# Altium schematic sheet Sheet_1_2023-01-05.schdoc
size 254 x 173 mm
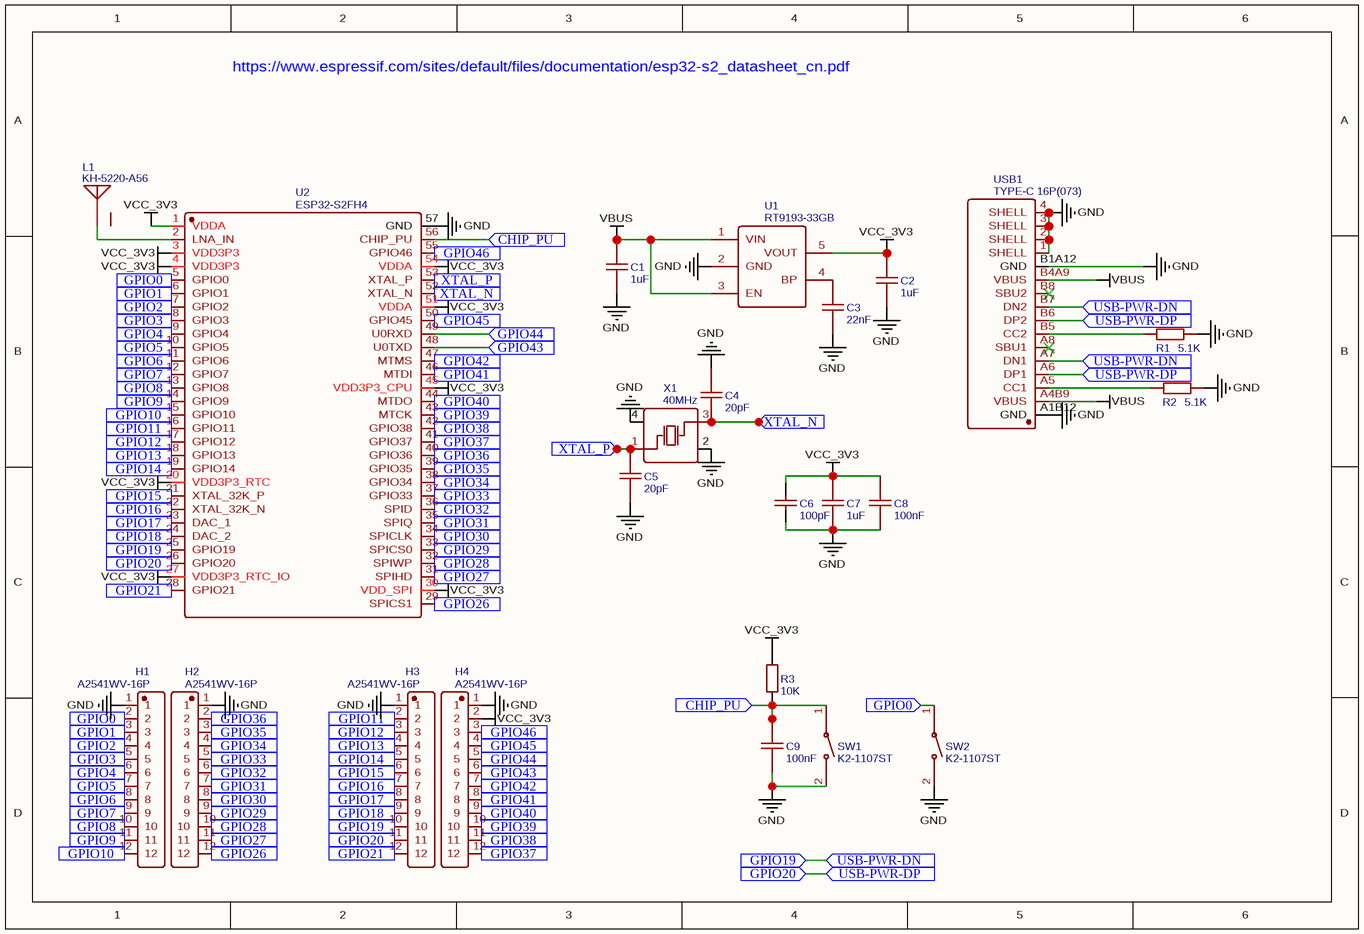
[diagram p0: Sheet_1_2023-01-05.schdoc]

## Parts
C1  1uF  [C0603]
C2  1uF  [C0603]
C3  22nF  [C0603]
C4  20pF  [C0603]
C5  20pF  [C0603]
C6  100pF  [C0603]
C7  1uF  [C0603]
C8  100nF  [C0603]
C9  100nF  [C0603]
H1  A2541WV-16P  [HDR-TH_12P-P2.54-V_A2541HWV-12P]
H2  A2541WV-16P  [HDR-TH_12P-P2.54-V_A2541HWV-12P]
H3  A2541WV-16P  [HDR-TH_12P-P2.54-V_A2541HWV-12P]
H4  A2541WV-16P  [HDR-TH_12P-P2.54-V_A2541HWV-12P]
L1  KH-5220-A56  [ANT-SMD_L5.2-W2.0]
R1  5.1K  [R0603]
R2  5.1K  [R0603]
R3  10K  [R0603]
SW1  K2-1107ST  [KEY-SMD_L6.2-W3.6-LS8.0]
SW2  K2-1107ST  [KEY-SMD_L6.2-W3.6-LS8.0]
U1  RT9193-33GB  [SOT-23-5_L3.0-W1.7-P0.95-LS2.8-BR]
U2  ESP32-S2FH4  [QFN-56_L7.0-W7.0-P0.40-TL-EP4.0]
USB1  TYPE-C 16P(073)  [USB-C-SMD_TYPE-C16PIN_C668624]
X1  40MHz  [OSC-SMD_4P-L3.2-W2.5-BL_SIT8008BI]

## Ports
CHIP_PU (in), GPIO0 (in), GPIO1 (in), GPIO2 (in), GPIO3 (in), GPIO4 (in), GPIO5 (in), GPIO6 (in), GPIO7 (in), GPIO8 (in), GPIO9 (in), GPIO10 (in), GPIO11 (in), GPIO12 (in), GPIO13 (in), GPIO14 (in), GPIO15 (in), GPIO16 (in), GPIO17 (in), GPIO18 (in), GPIO19 (in), GPIO20 (in), GPIO21 (in), GPIO26 (in), GPIO27 (in), GPIO28 (in), GPIO29 (in), GPIO30 (in), GPIO31 (in), GPIO32 (in), GPIO33 (in), GPIO34 (in), GPIO35 (in), GPIO36 (in), GPIO37 (in), GPIO38 (in), GPIO39 (in), GPIO40 (in), GPIO41 (in), GPIO42 (in), GPIO43 (in), GPIO44 (in), GPIO45 (in), GPIO46 (in), USB-PWR-DN (in), USB-PWR-DP (in), XTAL_N (in), XTAL_P (in)

## Nets
GND: C1.2 C2.2 C3.1 C4.2 C5.1 C6.1 C7.1 C8.2 C9.2 H1.1 H2.1 H3.1 H4.1 R1.2 R2.2 SW1.2 SW2.2 U1.2(GND) U2.57(GND) USB1.1(SHELL) USB1.2(SHELL) USB1.3(SHELL) USB1.4(SHELL) USB1.A1B12(GND) USB1.B1A12(GND) X1.2(GND) X1.4(GND)
VBUS: C1.1 U1.1(VIN) U1.3(EN) USB1.A4B9(VBUS) USB1.B4A9(VBUS)
VCC_3V3: C2.1 C6.2 C7.2 C8.1 H4.2 R3.2 U1.5(VOUT) U2.1(VDDA) U2.3(VDD3P3) U2.4(VDD3P3) U2.20(VDD3P3_RTC) U2.27(VDD3P3_RTC_IO) U2.30(VDD_SPI) U2.45(VDD3P3_CPU) U2.51(VDDA) U2.54(VDDA)
CHIP_PU: C9.1 R3.1 SW1.1 U2.56(CHIP_PU) ; port CHIP_PU
GPIO0: H1.2 SW2.1 U2.5(GPIO0) ; port GPIO0
GPIO1: H1.3 U2.6(GPIO1) ; port GPIO1
GPIO2: H1.4 U2.7(GPIO2) ; port GPIO2
GPIO3: H1.5 U2.8(GPIO3) ; port GPIO3
GPIO4: H1.6 U2.9(GPIO4) ; port GPIO4
GPIO5: H1.7 U2.10(GPIO5) ; port GPIO5
GPIO6: H1.8 U2.11(GPIO6) ; port GPIO6
GPIO7: H1.9 U2.12(GPIO7) ; port GPIO7
GPIO8: H1.10 U2.13(GPIO8) ; port GPIO8
GPIO9: H1.11 U2.14(GPIO9) ; port GPIO9
GPIO10: H1.12 U2.15(GPIO10) ; port GPIO10
GPIO11: H3.2 U2.16(GPIO11) ; port GPIO11
GPIO12: H3.3 U2.17(GPIO12) ; port GPIO12
GPIO13: H3.4 U2.18(GPIO13) ; port GPIO13
GPIO14: H3.5 U2.19(GPIO14) ; port GPIO14
GPIO15: H3.6 U2.21(XTAL_32K_P) ; port GPIO15
GPIO16: H3.7 U2.22(XTAL_32K_N) ; port GPIO16
GPIO17: H3.8 U2.23(DAC_1) ; port GPIO17
GPIO18: H3.9 U2.24(DAC_2) ; port GPIO18
GPIO19: H3.10 U2.25(GPIO19) USB1.A7(DN1) USB1.B7(DN2) ; port USB-PWR-DN, port GPIO19
GPIO20: H3.11 U2.26(GPIO20) USB1.A6(DP1) USB1.B6(DP2) ; port USB-PWR-DP, port GPIO20
GPIO21: H3.12 U2.28(GPIO21) ; port GPIO21
GPIO26: H2.12 U2.29(SPICS1) ; port GPIO26
GPIO27: H2.11 U2.31(SPIHD) ; port GPIO27
GPIO28: H2.10 U2.32(SPIWP) ; port GPIO28
GPIO29: H2.9 U2.33(SPICS0) ; port GPIO29
GPIO30: H2.8 U2.34(SPICLK) ; port GPIO30
GPIO31: H2.7 U2.35(SPIQ) ; port GPIO31
GPIO32: H2.6 U2.36(SPID) ; port GPIO32
GPIO33: H2.5 U2.37(GPIO33) ; port GPIO33
GPIO34: H2.4 U2.38(GPIO34) ; port GPIO34
GPIO35: H2.3 U2.39(GPIO35) ; port GPIO35
GPIO36: H2.2 U2.40(GPIO36) ; port GPIO36
GPIO37: H4.12 U2.41(GPIO37) ; port GPIO37
GPIO38: H4.11 U2.42(GPIO38) ; port GPIO38
GPIO39: H4.10 U2.43(MTCK) ; port GPIO39
GPIO40: H4.9 U2.44(MTDO) ; port GPIO40
GPIO41: H4.8 U2.46(MTDI) ; port GPIO41
GPIO42: H4.7 U2.47(MTMS) ; port GPIO42
GPIO43: H4.6 U2.48(U0TXD) ; port GPIO43
GPIO44: H4.5 U2.49(U0RXD) ; port GPIO44
GPIO45: H4.4 U2.50(GPIO45) ; port GPIO45
GPIO46: H4.3 U2.55(GPIO46) ; port GPIO46
XTAL_N: C4.1 U2.52(XTAL_N) X1.3(OSC2) ; port XTAL_N
XTAL_P: C5.2 U2.53(XTAL_P) X1.1(OSC1) ; port XTAL_P
NetC3_2: C3.2 U1.4(BP)
NetL1_1: L1.1(ANT) U2.2(LNA_IN)
NetR1_1: R1.1 USB1.B5(CC2)
NetR2_1: R2.1 USB1.A5(CC1)

Not connected (* = marked no-connect by the designer): L1 2; USB1 A8(SBU1)* B8(SBU2)*

## Notes on the sheet
- https://www.espressif.com/sites/default/files/documentation/esp32-s2_datasheet_cn.pdf

## Library data of the parts
C1 C2 C7 = 1uF: BOM_Manufacturer: YAGEO; BOM_Manufacturer Part: AC0603KRX7R6BB105; nameAlias: Capacitance; Contributor: LCSC; BOM_Supplier: LCSC; BOM_Supplier Part: C726554; BOM_JLCPCB Part Class: Extended Part; spicePre: C; spiceSymbolName: AC0603KRX7R6BB105
C3 = 22nF: BOM_Manufacturer: KEMET; BOM_Manufacturer Part: C0603C223K5RAC3121; nameAlias: Capacitance; Contributor: LCSC; BOM_Supplier: LCSC; BOM_Supplier Part: C599708; BOM_JLCPCB Part Class: Extended Part; spicePre: C; spiceSymbolName: C0603C223K5RAC3121
C4 C5 = 20pF: BOM_Manufacturer: KEMET; BOM_Manufacturer Part: C0603C200J5GAC7867; nameAlias: Capacitance; Contributor: LCSC; BOM_Supplier: LCSC; BOM_Supplier Part: C599688; BOM_JLCPCB Part Class: Extended Part; spicePre: C; spiceSymbolName: C0603C200J5GAC7867
C6 = 100pF: BOM_Manufacturer: YAGEO; BOM_Manufacturer Part: CC0603KRX7R9BB101; nameAlias: Capacitance; Contributor: LCSC; BOM_Supplier: LCSC; BOM_Supplier Part: C160903; BOM_JLCPCB Part Class: Extended Part; spicePre: C; spiceSymbolName: CC0603KRX7R9BB101
C8 C9 = 100nF: BOM_Manufacturer: YAGEO; BOM_Manufacturer Part: AC0603KRX7R8BB104; nameAlias: Capacitance; Contributor: LCSC; BOM_Supplier: LCSC; BOM_Supplier Part: C327096; BOM_JLCPCB Part Class: Extended Part; spicePre: C; spiceSymbolName: AC0603KRX7R8BB104
H1-H4 = A2541WV-16P: BOM_Manufacturer: Changjiang Connectors; BOM_Manufacturer Part: A2541WV-12P; Contributor: LCSC; BOM_Supplier: LCSC; BOM_Supplier Part: C225487; spicePre: H; spiceSymbolName: A2541WV-16P
L1 = KH-5220-A56: BOM_Manufacturer: Shenzhen Kinghelm Elec; Contributor: LCSC; BOM_Supplier: LCSC; BOM_Supplier Part: C504003; BOM_Manufacturer Part: KH-5220-A56; BOM_JLCPCB Part Class: Extended Part; spicePre: L; spiceSymbolName: KH-5220-A56
R1 R2 = 5.1K: BOM_Manufacturer: PANASONIC; BOM_Manufacturer Part: ERJ-3EKF5101V; nameAlias: Resistance (Ohms); Contributor: LCSC; BOM_Supplier: LCSC; BOM_Supplier Part: C123727; BOM_JLCPCB Part Class: Extended Part; spicePre: R; spiceSymbolName: ERJ-3EKF5101V
R3 = 10K: BOM_Manufacturer: YAGEO; BOM_Manufacturer Part: RC0603DR-0710KL; nameAlias: Resistance (Ohms); Contributor: LCSC; Resistance: 10kΩ; BOM_Supplier: LCSC; BOM_Supplier Part: C137819; BOM_JLCPCB Part Class: Extended Part; spicePre: R; spiceSymbolName: RC0603DR-0710KL
SW1 SW2 = K2-1107ST: BOM_Manufacturer: Rectangular Connectors - Contacts; BOM_Manufacturer Part: K2-1107ST-A4SW-06; Contributor: LCSC; BOM_Supplier: LCSC; BOM_Supplier Part: C118141; BOM_JLCPCB Part Class: Extended Part; spicePre: S; spiceSymbolName: K2-1107ST-A4SW-06
U1 = RT9193-33GB: BOM_Manufacturer: RICHTEK; BOM_Supplier: LCSC; BOM_Manufacturer Part: RT9193-33GB; BOM_Supplier Part: C15651; BOM_JLCPCB Part Class: Extended Part; spicePre: U; spiceSymbolName: RT9193-33GB
U2 = ESP32-S2FH4: BOM_Manufacturer: ESPRESSIF 乐鑫; Contributor: LCSC; BOM_Supplier: LCSC; BOM_Supplier Part: C2840995; BOM_Manufacturer Part: ESP32-S2FH4; BOM_JLCPCB Part Class: Extended Part; spicePre: U; spiceSymbolName: ESP32-S2FH4
USB1 = TYPE-C 16P(073): BOM_Manufacturer: SHOU HAN; Contributor: LCSC; BOM_Supplier: LCSC; BOM_Supplier Part: C668624; BOM_Manufacturer Part: TYPE-C 16P(073); BOM_JLCPCB Part Class: Extended Part; spicePre: U; spiceSymbolName: TYPE-C 16P(073)
X1 = 40MHz: BOM_Manufacturer: YXC; BOM_Manufacturer Part: X322540MPB4SI; nameAlias: Frequency; BOM_Supplier: LCSC; BOM_Supplier Part: C9010; BOM_JLCPCB Part Class: Extended Part; spicePre: X; spiceSymbolName: X322540MPB4SI